# EasyEDA Pro project TLV493D-triple.eprj

# Schematic Schematic1
Board Name: Board1; Create Date: 2025-05-01; Page Name: P1; Project Name: TLV493D-triple; Schematic Name: Schematic1; Update Date: 2025-05-04; Company: 嘉立创EDA; Page Size: A4; Version: V1.0
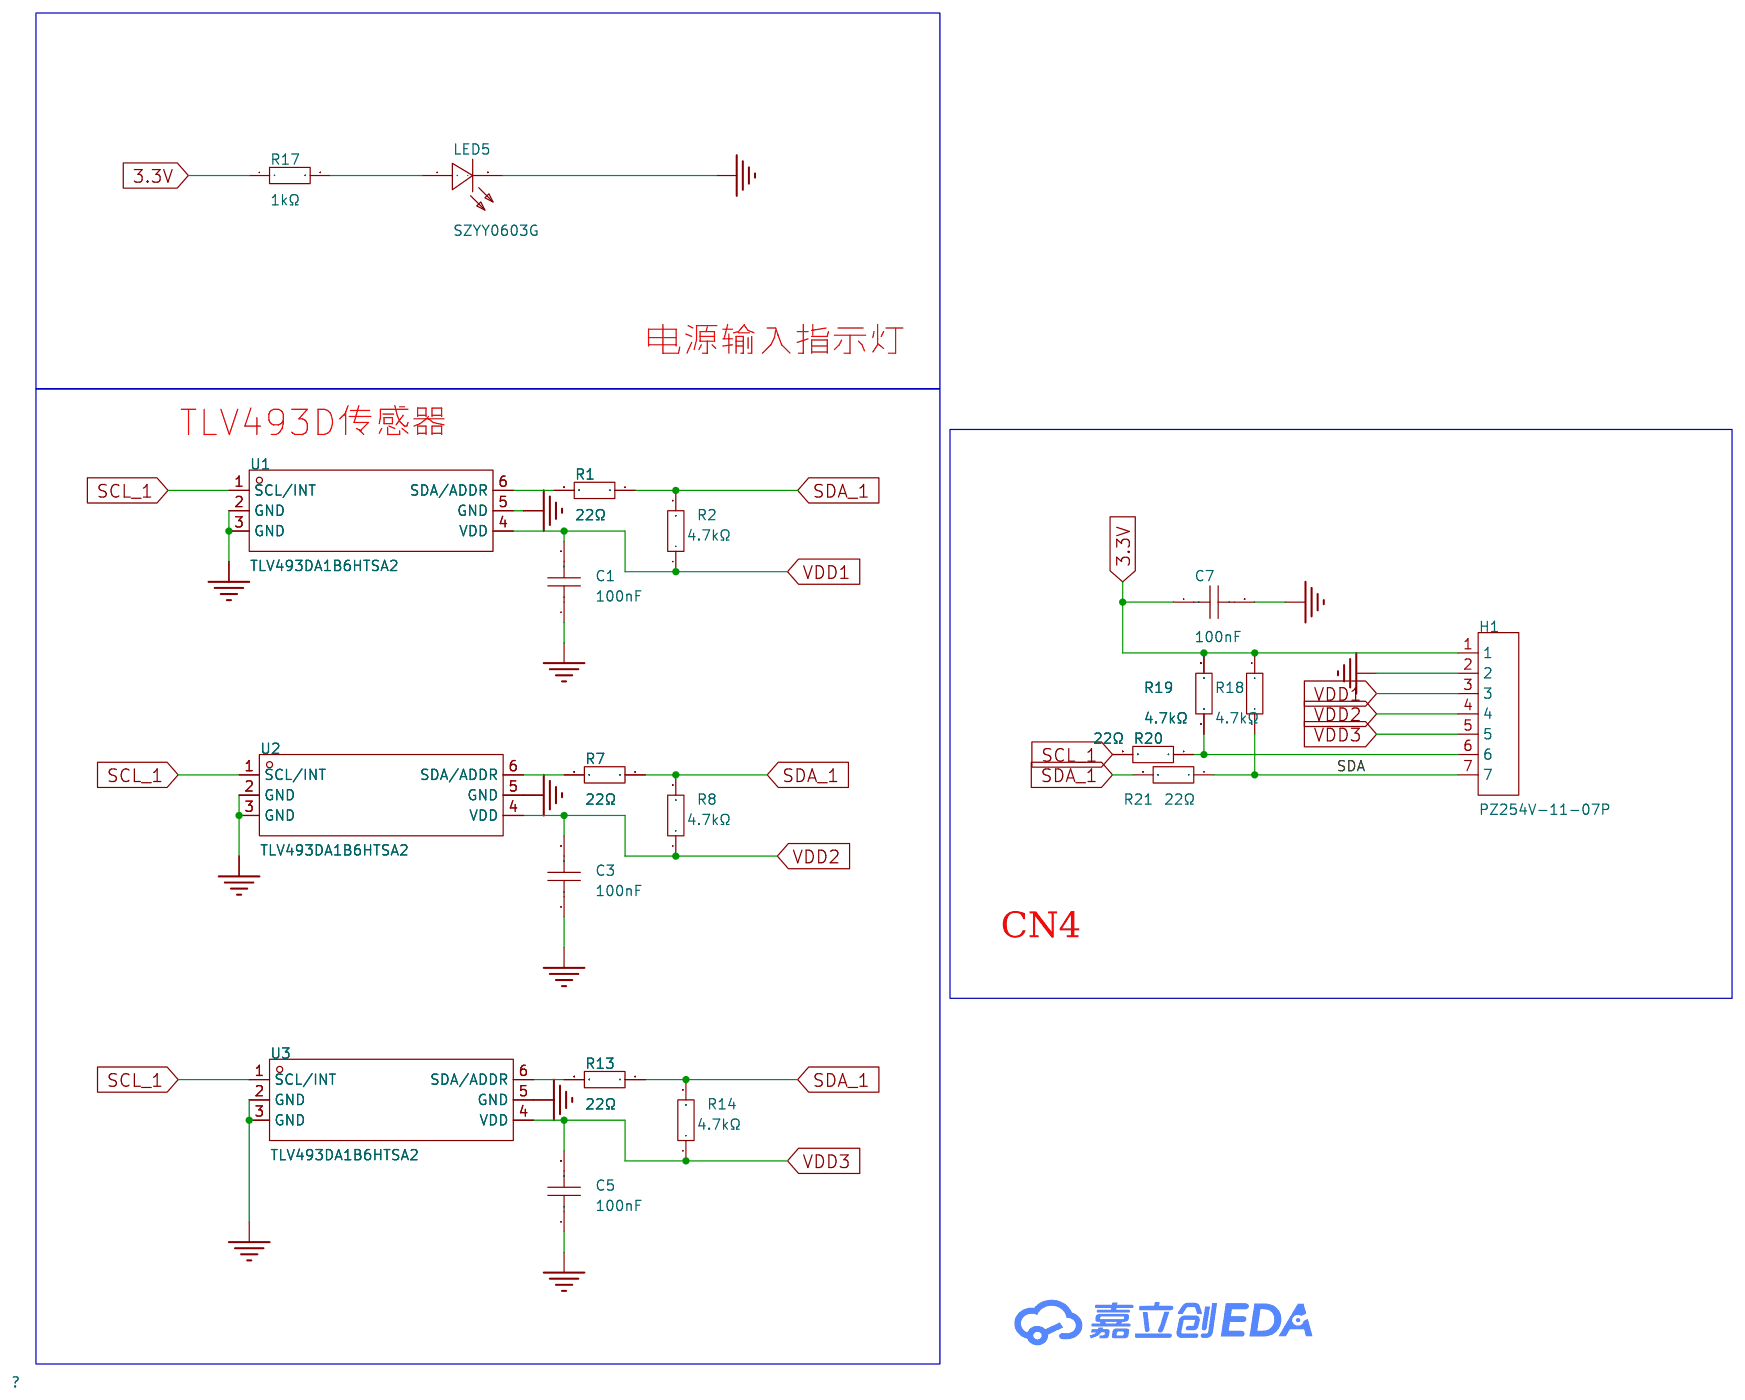
[diagram p0: schematic sheet]

## Parts
C1  100nF  [C0603]
C3  100nF  [C0603]
C5  100nF  [C0603]
C7  100nF  [C0603]
H1  PZ254V-11-07P  [HDR-TH_7P-P2.54-V-M]
LED5  SZYY0603G  [LED0603-R-RD_GREEN]
R1  22Ω  [R0603]
R2  4.7kΩ  [R0603]
R7  22Ω  [R0603]
R8  4.7kΩ  [R0603]
R13  22Ω  [R0603]
R14  4.7kΩ  [R0603]
R17  1kΩ  [R0603]
R18  4.7kΩ  [R0603]
R19  4.7kΩ  [R0603]
R20  22Ω  [R0603]
R21  22Ω  [R0603]
U1  TLV493DA1B6HTSA2  [SOP-6_L3.0-W1.5-P0.95-LS2.5-BR]
U2  TLV493DA1B6HTSA2  [SOP-6_L3.0-W1.5-P0.95-LS2.5-BR]
U3  TLV493DA1B6HTSA2  [SOP-6_L3.0-W1.5-P0.95-LS2.5-BR]

## Library data of the parts
C1 C3 C5 C7 = CGA0603X7R104K500JT: LCSC Part Name: 100nF ±10% 50V; Supplier Part: C6119867; Manufacturer: HRE(芯声); Supplier Footprint: 0603; JLCPCB Part Class: 扩展库; Datasheet: https://atta.szlcsc.com/upload/public/pdf/source/20250103/C44077DA9E7B3EFAE02F22B6D3D1CBC9.pdf; Supplier: LCSC; Tolerance: ±10%; Voltage Rating: 50V; Temperature Coefficient: X7R
H1 = PZ254V-11-07P: LCSC Part Name: 1x7P 间距:2.54mm 方针 直插; Supplier Part: C492406; Manufacturer: XFCN(兴飞); Supplier Footprint: 插件,P=2.54mm; JLCPCB Part Class: 扩展库; Datasheet: https://atta.szlcsc.com/upload/public/pdf/source/20200309/C492406_654C533EE691117E22DD9F76C114C2D9.pdf; Supplier: LCSC; Pin Structure: 1x7P; Pitch: 2.54mm; Circluar Pins/Square Pins: 方针; Mounting Type: 直插; Number of Rows: 单排; Number of Pins: 7P; Length of Mating Pin: 6mm; Insulation Height: 2.5mm; Length of End Connection Pin: 3mm; Contact Material: 黄铜; Operating Temperature: -40℃~+105℃; Color: 黑色
LED5 = SZYY0603G: LCSC Part Name: 翠绿; Supplier Part: C434420; Manufacturer: yongyu(永裕光电); Supplier Footprint: 0603; JLCPCB Part Class: 扩展库; Datasheet: https://atta.szlcsc.com/upload/public/pdf/source/20191204/C434420_28D8AC31297B1E2177F31D28DAFFED5A.pdf; Supplier: LCSC; Emitted Color: 翠绿色
R1 R7 R13 R20 R21 = 0603WAF220JT5E: LCSC Part Name: 22Ω ±1% 100mW 厚膜电阻; Supplier Part: C23345; Manufacturer: UNI-ROYAL(厚声); Supplier Footprint: 0603; JLCPCB Part Class: 基础库; Datasheet: https://atta.szlcsc.com/upload/public/pdf/source/20200306/C422600_1E6D84923E4A46A82E41ADD87F860B5C.pdf; Supplier: LCSC; Type: 厚膜电阻; Tolerance: ±1%; Power(Watts): 100mW; Overload Voltage (Max): 75V; Temperature Coefficient: ±100ppm/℃; Operating Temperature Range: -55℃~+155℃
R2 R8 R14 R18 R19 = 0603WAF4701T5E: LCSC Part Name: 4.7kΩ ±1% 100mW 厚膜电阻; Supplier Part: C23162; Manufacturer: UNI-ROYAL(厚声); Supplier Footprint: 0603; JLCPCB Part Class: 基础库; Datasheet: https://atta.szlcsc.com/upload/public/pdf/source/20200306/C422600_1E6D84923E4A46A82E41ADD87F860B5C.pdf; Supplier: LCSC; Type: 厚膜电阻; Tolerance: ±1%; Power(Watts): 100mW; Overload Voltage (Max): 75V; Temperature Coefficient: ±100ppm/℃; Operating Temperature Range: -55℃~+155℃
R17 = 0603WAF1001T5E: LCSC Part Name: 1kΩ ±1% 100mW 厚膜电阻; Supplier Part: C21190; Manufacturer: UNI-ROYAL(厚声); Supplier Footprint: 0603; JLCPCB Part Class: 基础库; Datasheet: https://atta.szlcsc.com/upload/public/pdf/source/20200306/C422600_1E6D84923E4A46A82E41ADD87F860B5C.pdf; Supplier: LCSC; Type: 厚膜电阻; Tolerance: ±1%; Power(Watts): 100mW; Overload Voltage (Max): 75V; Temperature Coefficient: ±100ppm/℃; Operating Temperature Range: -55℃~+155℃
U1-U3 = TLV493DA1B6HTSA2: LCSC Part Name: 磁场传感器; Supplier Part: C126688; Manufacturer: Infineon(英飞凌); Supplier Footprint: SOP-6-1.5mm; JLCPCB Part Class: 扩展库; Datasheet: https://atta.szlcsc.com/upload/public/pdf/source/20170818/C126688_1503051290851895354.pdf; Supplier: LCSC

## Nets
3.3V: C7.1 H1.1 R17.1 R18.2 R19.2
GND: C1.1 C3.1 C5.1 C7.2 H1.2 LED5.2(-) U1.2(GND) U1.3(GND) U1.5(GND) U2.2(GND) U2.3(GND) U2.5(GND) U3.2(GND) U3.3(GND) U3.5(GND)
VDD1: C1.2 H1.3 R2.1 U1.4(VDD)
VDD2: C3.2 H1.4 R8.1 U2.4(VDD)
VDD3: C5.2 H1.5 R14.1 U3.4(VDD)
SCL: H1.6 R19.1 R20.1
SCL_1: R20.2 U1.1(SCL/INT) U2.1(SCL/INT) U3.1(SCL/INT)
SDA: H1.7 R18.1 R21.1
SDA_1: R1.1 R2.2 R7.1 R8.2 R13.1 R14.2 R21.2
$1N2922: LED5.1(+) R17.2
$1N4037: R1.2 U1.6(SDA/ADDR)
$1N4282: R7.2 U2.6(SDA/ADDR)
$1N4384: R13.2 U3.6(SDA/ADDR)

## Notes on the sheet
- 电源输入指示灯
- TLV493D传感器
- CN4

# Board PCB1
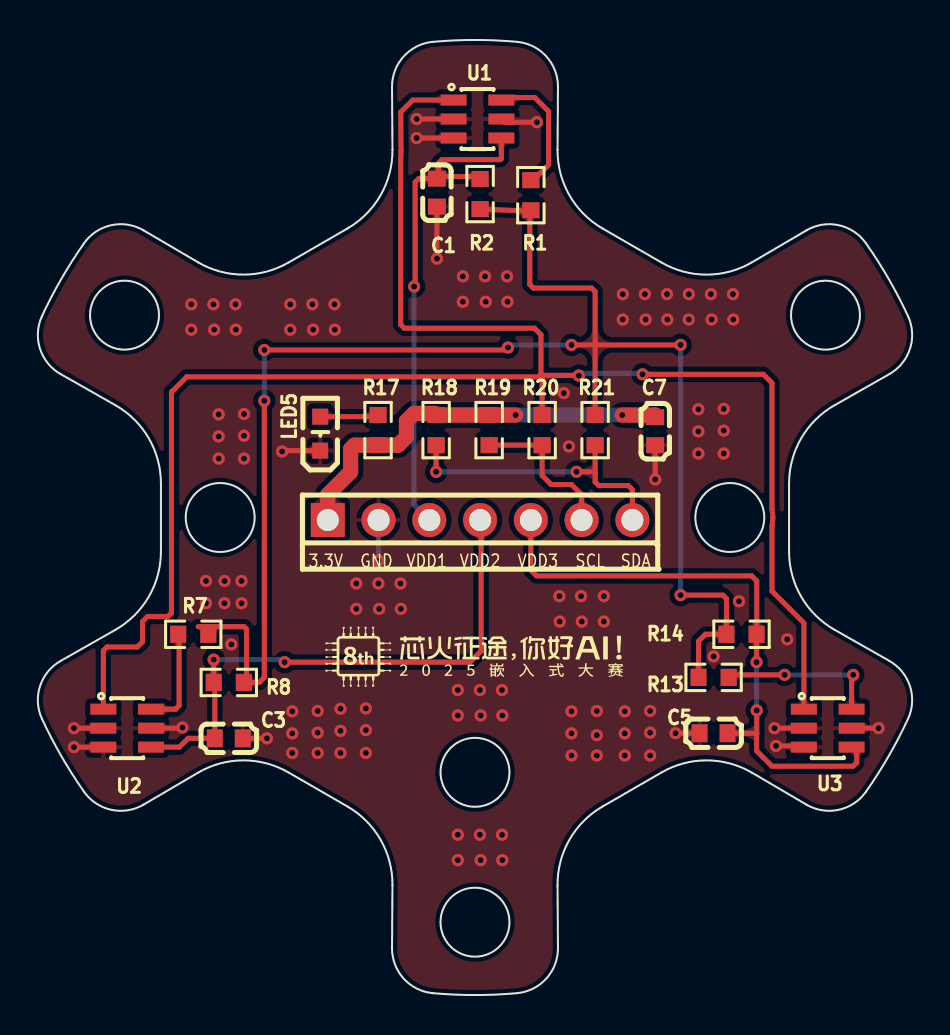
[diagram p1: board, top side]
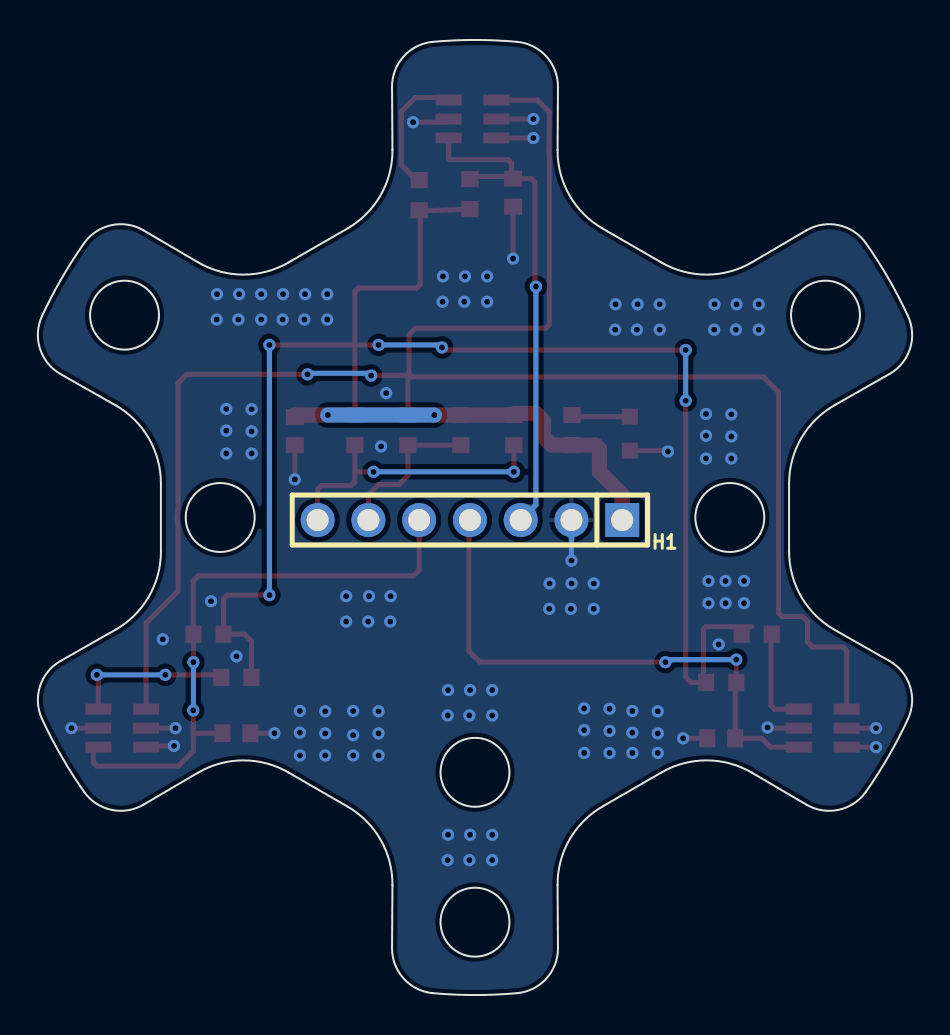
[diagram p2: board, bottom side, seen from below]

Outline 43.75 x 47.79 mm; copper layers: Top Layer, Bottom Layer. Coordinates in mm from the lower left corner of the outline.
Outline path: circle c4.34,34.02 r1.72 ; circle c9.12,23.9 r1.72 ; circle c21.87,11.15 r1.72 ; circle c21.87,3.65 r1.72 ; circle c34.62,23.9 r1.72 ; circle c39.41,34.02 r1.73 ; 0.21,33.98 arc(1.18,35.84) 2.31,37.61 arc(3.67,38.52) 5.29,38.26 8.01,36.67 arc(10.27,36.05) 12.54,36.65 15.49,38.36 arc(17.15,40.02) 17.74,42.29 17.72,45.44 arc(18.31,46.97) 19.77,47.7 arc(21.87,47.79) 23.97,47.7 arc(25.44,46.97) 26.02,45.44 26,42.29 arc(26.6,40.02) 28.25,38.36 31.21,36.65 arc(33.47,36.05) 35.74,36.67 38.46,38.26 arc(40.07,38.52) 41.44,37.61 arc(42.57,35.84) 43.54,33.98 arc(43.64,32.34) 42.61,31.07 39.87,29.51 arc(38.2,27.86) 37.59,25.6 37.59,22.19 arc(38.2,19.93) 39.87,18.28 42.61,16.72 arc(43.64,15.45) 43.54,13.81 arc(42.57,11.95) 41.44,10.18 arc(40.07,9.27) 38.46,9.53 35.74,11.12 arc(33.47,11.74) 31.21,11.14 28.25,9.43 arc(26.6,7.77) 26,5.51 26.02,2.35 arc(25.44,0.82) 23.97,0.09 arc(21.87,0) 19.77,0.09 arc(18.31,0.82) 17.72,2.35 17.74,5.51 arc(17.15,7.77) 15.49,9.43 12.54,11.14 arc(10.27,11.74) 8.01,11.12 5.29,9.53 arc(3.67,9.27) 2.31,10.18 arc(1.18,11.95) 0.21,13.81 arc(0.11,15.45) 1.14,16.72 3.88,18.28 arc(5.55,19.93) 6.16,22.19 6.16,25.6 arc(5.55,27.86) 3.88,29.51 1.14,31.07 arc(0.11,32.34) 0.21,33.98
Stack: Top Layer 0.035mm / Dielectric1 1.51mm FR4 er 4.5 / Bottom Layer 0.035mm

## Design rules (mm)
template: JLCPCB Capability(Two Layers Board)
spacing copperThickness1oz (default): track to track 0.102, other pairs 0.152 to 0.3
spacing copperThickness2oz: track to track 0.203, other pairs 0.152 to 0.3
track width copperThickness1oz (default): min 0.127, default 0.254, max 2.54
track width copperThickness2oz: min 0.203, default 0.254, max 2.54
differential pair differentialPair (default): width min 0.127, default 0.254, max 2.54; gap min 0.152, default 0.152
via viaSize (default): diameter min 0.5, default 0.61, max 10; hole min 0.3, default 0.305, max 6.3

## Placement (name value [footprint] x y rotation side)
C1  100nF  [C0603]  19.97 40.15 90 top
C3  100nF  [C0603]  9.55 12.85 180 top
C5  100nF  [C0603]  33.81 13.1 0 top
C7  100nF  [C0603]  30.89 28.21 270 top
H1  PZ254V-11-07P  [HDR-TH_7P-P2.54-V-M]  22.13 23.77 0 bottom
LED5  SZYY0603G  [LED0603-R-RD_GREEN]  14.13 28.09 90 top
R1  22Ω  [R0603]  24.67 40.02 90 top
R2  4.7kΩ  [R0603]  22.13 40.08 270 top
R7  22Ω  [R0603]  7.78 18.05 180 top
R8  4.7kΩ  [R0603]  9.55 15.64 0 top
R13  22Ω  [R0603]  33.81 15.89 0 top
R14  4.7kΩ  [R0603]  35.21 18.05 180 top
R17  1kΩ  [R0603]  17.02 28.27 90 top
R18  4.7kΩ  [R0603]  19.93 28.27 90 top
R19  4.7kΩ  [R0603]  22.58 28.27 90 top
R20  22Ω  [R0603]  25.23 28.27 90 top
R21  22Ω  [R0603]  27.88 28.27 90 top
U1  TLV493DA1B6HTSA2  [SOP-6_L3.0-W1.5-P0.95-LS2.5-BR]  22 43.83 180 top
U2  TLV493DA1B6HTSA2  [SOP-6_L3.0-W1.5-P0.95-LS2.5-BR]  4.47 13.35 180 top
U3  TLV493DA1B6HTSA2  [SOP-6_L3.0-W1.5-P0.95-LS2.5-BR]  39.53 13.35 180 top

## Footprints (pads in the part's own frame, mm; a bottom-side part is the same pattern mirrored in y, then rotated)
C0603
  rect 0.8x0.9 smd: 1(-0.7,0) 2(0.7,0)
HDR-TH_7P-P2.54-V-M
  rect 1.7x1.7 hole 1.1: 1(-7.62,0)
  round 1.7 hole 1.1: 2(-5.08,0) 3(-2.54,0) 4(0,0) 5(2.54,0) 6(5.08,0) 7(7.62,0)
LED0603-R-RD_GREEN
  rect 0.8x0.8 smd: 1(0.851,0) 2(-0.851,0)
R0603
  rect 0.806x0.864 smd: 1(-0.753,0) 2(0.753,0)
SOP-6_L3.0-W1.5-P0.95-LS2.5-BR
  rect 1.3x0.55 smd: 1(1.197,-0.95) 2(1.197,0) 3(1.197,0.95) 4(-1.19,0.95) 5(-1.197,0) 6(-1.19,-0.95)

## Nets
As in the schematic.

## Via types
v1: diameter 0.61, hole 0.305, Top Layer to Bottom Layer, 136 vias

## Routing (per net, layer and track width the routed paths; a pad name or vN(x,y) marks a point on that pad's centre or on a via; arc(x,y) is an arc through that point)
3.3V: length 20.6
  Top Layer w0.762: v1(29.24,29.02) 30.89,29.02 C7.1 ; v1(23.91,29.02) R19.2 R18.2 19.85,29.1 18.83,29.1 18.45,28.72 18.45,27.93 18.03,27.52 R17.1 15.85,27.52 15.65,27.32 15.65,26.18 14.51,25.04 H1.1
  Bottom Layer w0.762: v1(23.91,29.02) v1(29.24,29.02)
GND: length 25
  Top Layer w0.254: U1.3 v1(18.96,42.88) ; 14.13,27.24 12.27,27.24 v1(12.22,27.2) ; U3.2 v1(36.86,13.35) ; U2.3 v1(1.81,12.4) ; U3.3 38.27,12.47 v1(36.94,12.47) ; C5.1 v1(31.91,13.1) ; U2.2 v1(1.81,13.35) ; U3.5 v1(42.07,13.35) ; 10.26,12.85 v1(11.46,12.85) ; C7.2 v1(30.89,25.8) ; U2.5 7.27,13.35 ; v1(24.98,43.68) 23.36,43.68 U1.5 ; C1.1 v1(19.97,36.85) ; U1.2 v1(18.96,43.83)
  Bottom Layer w0.254: H1.2 v1(17.05,21.74)
  vias: v1(7.24,13.39) v1(7.68,34.56) v1(7.68,33.29) v1(8.41,20.72) v1(8.41,19.61) v1(8.78,34.56) v1(8.82,33.29) v1(9.05,29.06) v1(9.05,27.95) v1(9.05,26.85) v1(9.34,20.72) v1(9.34,19.61) v1(9.68,17.55) v1(9.89,34.56) v1(9.91,33.29) v1(10.19,20.72) v1(10.19,19.61) v1(10.32,29.07) v1(10.32,27.99) v1(10.32,26.85) v1(12.63,34.56) v1(12.63,33.29) v1(12.73,14.2) v1(12.73,13.09) v1(12.73,12.11) v1(13.74,34.56) v1(13.77,33.29) v1(14,14.21) v1(14,13.13) v1(14,12.11) v1(14.84,34.56) v1(14.86,33.29) v1(15.14,14.32) v1(15.14,13.22) v1(15.14,12.11) v1(15.93,20.59) v1(15.93,19.32) v1(16.41,14.34) v1(16.41,13.26) v1(16.41,12.11) v1(17.04,20.59) v1(17.08,19.32) v1(18.14,20.59) v1(18.16,19.32) v1(21.01,15.26) v1(21.01,13.99) v1(21.01,8.02) v1(21.01,6.75) v1(21.27,35.96) v1(21.27,34.69) v1(22.12,15.26) v1(22.16,13.99) v1(22.12,8.02) v1(22.16,6.75) v1(22.37,35.96) v1(22.41,34.69) v1(23.22,15.26) v1(23.24,13.99) v1(23.22,8.02) v1(23.24,6.75) v1(23.48,35.96) v1(23.5,34.69) v1(26.09,19.96) v1(26.11,18.69) v1(26.32,30.12) v1(26.57,27.45) v1(26.7,14.2) v1(26.7,13.09) v1(26.7,11.99) v1(27.18,19.96) v1(27.22,18.69) v1(27.97,14.21) v1(27.97,13) v1(27.97,11.99) v1(28.32,19.96) v1(28.32,18.69) v1(29.27,35.07) v1(29.27,33.8) v1(29.37,14.2) v1(29.37,13.09) v1(29.37,11.99) v1(30.37,35.07) v1(30.41,33.8) v1(30.64,14.21) v1(30.64,13.13) v1(30.64,11.99) v1(31.48,35.07) v1(31.5,33.8) v1(32.57,35.07) v1(32.57,33.8) v1(33.05,29.31) v1(33.05,28.2) v1(33.05,27.1) v1(33.68,35.07) v1(33.71,33.8) v1(33.81,16.94) v1(34.32,29.33) v1(34.32,28.24) v1(34.32,27.1) v1(34.78,35.07) v1(34.8,33.8) v1(35.08,19.7) v1(37.49,17.8)
VDD1: length 25.6
  Top Layer w0.254: v1(18.83,35.45) 18.88,35.5 18.88,40.67 19.06,40.85 19.97,40.85 20.05,40.93 20.05,40.96 ; 23.19,42.76 23.19,41.85 23.15,41.8 20.23,41.8 20.05,41.62 20.05,40.96 ; 22.26,40.96 20.05,40.96
  Bottom Layer w0.254: v1(18.83,35.45) 18.83,24.53 H1.3
VDD2: length 27.6
  Top Layer w0.254: U2.4 7.08,12.4 7.52,12.85 C3.2 8.85,15.59 R8.1 v1(8.8,16.78) ; v1(12.35,16.66) 21.62,16.66 22.18,17.22 22.18,23.72 H1.4
  Bottom Layer w0.254: v1(8.8,16.78) 12.22,16.78 v1(12.35,16.66)
VDD3: length 30.3
  Top Layer w0.254: v1(35.97,14.24) 35.97,13.1 ; 35.97,13.1 35.97,13.1 35.97,12.22 36.74,11.45 40.8,11.45 40.98,11.63 40.98,12.15 40.72,12.4 ; 35.97,13.1 C5.2 ; H1.5 24.67,21.26 24.96,20.97 35.72,20.97 35.97,20.72 35.97,18.06 R14.1 v1(35.97,16.66)
  Bottom Layer w0.254: v1(35.97,14.24) 35.97,14.25 v1(35.97,16.66)
SCL: length 7.8
  Top Layer w0.254: 22.58,27.52 25.24,27.52 25.24,26 25.69,25.55 26.7,25.55 27.21,25.04 H1.6
SCL_1: length 91.5
  Top Layer w0.254: v1(27.07,31) 27.06,31.01 25.12,31.01 ; v1(30.26,31.06) 36.3,31.06 36.74,30.63 36.74,24.32 arc(36.77,24.11) 36.78,23.9 arc(36.77,23.68) 36.74,23.47 36.74,20.21 38.33,18.62 U3.1 ; 25.12,31.01 25.18,31.06 25.18,33.04 24.85,33.37 18.34,33.37 18.16,33.55 18.16,41.85 arc(18.17,42.07) 18.17,42.29 18.16,44.18 18.76,44.78 U1.1 ; 25.12,31.01 25.24,30.89 R20.2 ; 25.12,31.01 25.05,30.93 7.45,30.93 6.69,30.17 6.69,19.12 6.51,18.94 5.49,18.94 5.24,18.69 5.24,17.67 4.99,17.42 3.46,17.42 3.28,17.24 U2.1
  Bottom Layer w0.254: v1(30.26,31.06) 30.21,31.11 26.96,31.11 v1(27.07,31)
SDA: length 14.7
  Top Layer w0.254: H1.7 29.75,25.29 29.55,25.49 28.07,25.49 27.89,25.67 27.89,26.15 ; 19.93,27.52 v1(19.93,26.18) ; 27.89,26.15 27.86,26.18 v1(26.96,26.18) ; 27.89,26.15 27.89,27.52
  Bottom Layer w0.254: v1(19.93,26.18) v1(26.95,26.18)
SDA_1: length 79.5
  Top Layer w0.254: v1(32.16,32.53) 27.9,32.53 27.89,32.55 ; 24.63,39.23 R1.1 ; 24.63,39.23 24.62,39.22 24.62,35.56 24.8,35.38 27.71,35.38 27.89,35.2 27.89,32.55 ; 24.63,39.23 R2.2 ; v1(26.7,32.53) 27.87,32.53 27.89,32.55 ; 27.89,32.55 R21.2 ; v1(11.34,29.74) 11.34,15.89 11.08,15.64 R8.2 10.45,15.78 10.45,18.31 10.32,18.43 8.03,18.43 ; v1(23.53,32.4) 23.4,32.28 v1(11.34,32.28) ; v1(32.16,20.01) 34.28,20.01 34.46,19.83 R14.2 33.41,18.05 33.06,17.7 R13.1
  Bottom Layer w0.254: v1(23.53,32.4) 23.65,32.53 v1(26.7,32.53) ; v1(11.34,29.74) v1(11.34,32.28) ; v1(32.16,20.01) v1(32.16,32.53)
$1N2922: length 2.9
  Top Layer w0.254: R17.2 16.94,28.94 LED5.1
$1N4037: length 6.6
  Top Layer w0.254: R1.2 24.8,40.78 25.56,41.54 25.56,44.22 24.86,44.91 23.45,44.91 23.19,44.66
$1N4282: length 5.1
  Top Layer w0.254: R7.2 7.07,18.01 7.07,14.48 6.89,14.3 U2.6
$1N4384: length 8
  Top Layer w0.254: R13.2 34.7,16.02 v1(37.37,16.02) ; U3.6 40.72,15.94 v1(40.8,16.02)
  Bottom Layer w0.254: v1(40.8,16.02) v1(37.37,16.02)

## Copper pours and planes (outline as drawn; the poured copper is in the pictures)
GND on Top Layer: -4.16,49.93 51.08,49.93 51.08,-1.12 -4.16,-1.12
GND on Bottom Layer: -8.23,49.8 57.18,49.8 57.18,-1.76 -8.23,-1.76

Small or netless copper shapes (teardrops, artwork), in the pictures only: 94 on Top Layer, 20 on Bottom Layer

## Text on the board
Top Silkscreen Layer: 3.3V | GND | VDD1 | VDD2 | VDD3 | SCL | SDA
